# EAGLE design 5v Spannungsversorgung (EAGLE 7.1.0)
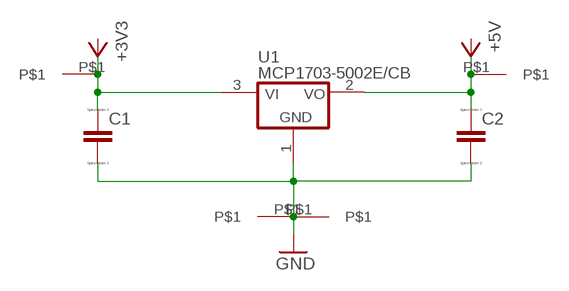
[diagram p0: schematic, sheet 1]

## Parts
C1  C-EUC0603K  [C0603K]
C2  C-EUC0603K  [C0603K]
U1  MCP1703-5002E/CB  [SOT23A_MICROCHIP_CB]
U$1  PAD  [PAD]
U$2  PAD  [PAD]
U$3  PAD  [PAD]
U$4  PAD  [PAD]

## Nets
GND: C1.2 C2.2 U1.1(GND) U$2.P$1 U$4.P$1
N$1: C1.1 U1.3(VI) U$3.P$1
N$2: C2.1 U1.2(VO) U$1.P$1

## Library data of the parts
C1 C2 = resistor:C-EU: CAPACITOR, European symbol; SPICEPREFIX: C
U1 = _hhn_MCP1703:MCP1703*02E/CB: MCP1703[A] Series of Voltage Regulators – SOT23A (Microchip CB) (1.2 … 5.0)V, LDO, 16 V Input, 100/150/200/250 mA, Low Quiescent Current Source: http://ww1.microchip.com/downloads/en/DeviceDoc/22049f.pdf http://ww1.microchip.com/downloads/en/DeviceDoc/25122A.pdf Packages: SOT23, Microchip package identifier "CB" (dimensions and recommended land patterns acc. to Microchip) Technologies: MCP1703[A]T-xx02E/CB T : Tape and Reel xx: Output Voltage * 1000 mV; 12|15|18|25|28|30|33|40|50 0 : Extra Feature Code (fixed) 2 : Output volt. Tol.: ±2% (standard) E : Temperature range (−40…+125)°C CB: Package: SOT23A Author: Dipl.-Ing. FH Rainer Bayer HHN Hochschule Heilbronn, rainer.bayer@hs-heilbronn.de Ingenieurbüro ing-rb, mail@ing-rb.de
U$1-U$4 = Pad:PAD

## Board
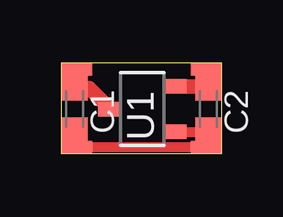
[diagram p1: board, top side]

Size 6.7 x 3.78 mm. Coordinates in mm from the lower left corner, seen from the top.
Outline: 0,0 6.7,0 6.7,3.78 0,3.78 0,0
Copper layers (1*16): Top 0.035mm / dielectric 1.5mm / Bottom 0.035mm
Design rules "default": minimum track width 10mil, minimum drill 24mil, track to track 8mil, track to pad 8mil, pad to pad 8mil, via to via 8mil, smd to smd 8mil, copper to edge 40mil, drill to drill 8mil, minimum pad ring 10mil, minimum via ring 8mil, stop-mask expansion 4mil, vias tented up to drill 0mil, thermal gap 10mil

### Footprints (pad centres in the part's own frame; a part is rotated, then mirrored left to right if it is on the bottom)
C0603K = smd 1.05 x 1.08: 1 -0.875,0; 2 0.875,0
SOT23A_MICROCHIP_CB = smd 0.6 x 1: 1 -0.95,-1.35; 2 0.95,-1.35; 3 0,1.35
PAD = smd 1.27 x 0.508: P$1 0,0

### Placement (x,y rotation side)
C1  0.55,1.86 270 top
C2  6.14,1.86 270 top
U1  3.38,1.86 90 top
U$1  6.04,3.51 0 top
U$2  0.65,0.27 0 top
U$3  0.65,3.51 0 top
U$4  6.04,0.27 0 top

### Tracks (layer width: path | path; a pad name or v marks a point on that pad's centre or on a via)
GND
  Top 0.406: C1.2 0.55,0.37 U$2.P$1 U$4.P$1 6.14,0.37 C2.2 6.07,0.91 U1.1
N$1
  Top 0.254: U$3.P$1 0.55,3.51 C1.1
  Top 0.61: C1.1 1.16,2.73 U1.3
N$2
  Top 0.406: U$1.P$1 6.04,2.83 C2.1
  Top 0.61: U1.2 6.07,2.81 C2.1